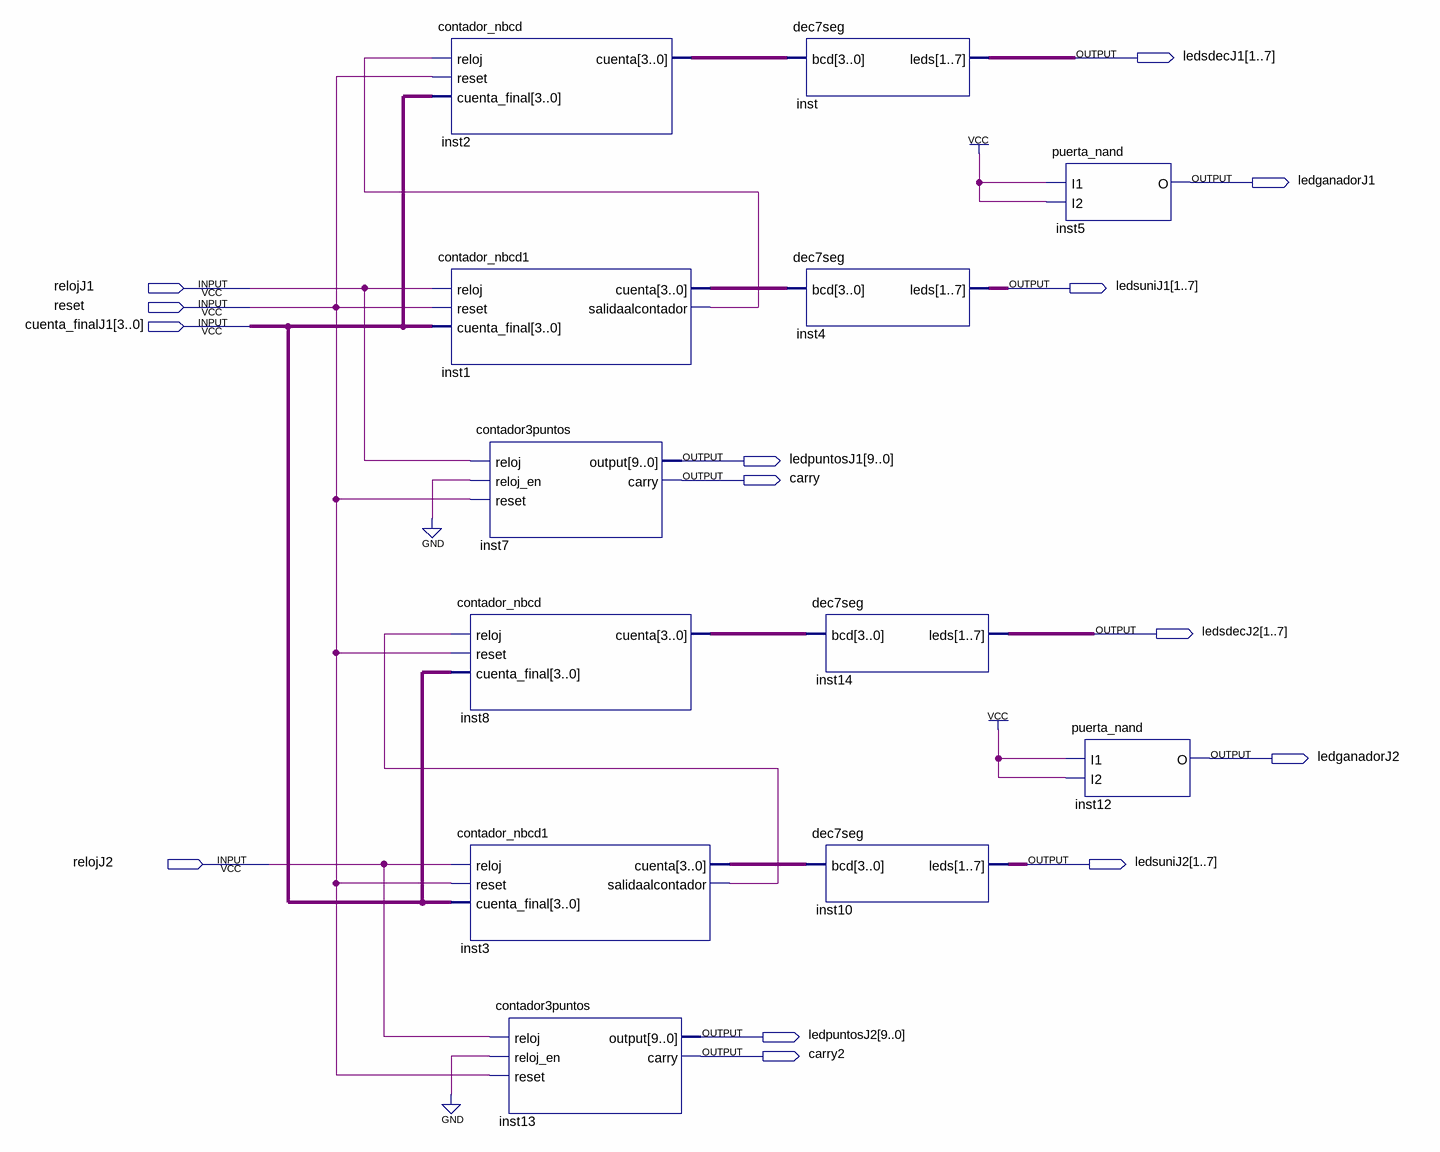
[diagram p0: schematic sheet]
// Quartus schematic Block1.bdf as structural Verilog: 12 symbols, 14 pins
module Block1 (
  input  relojJ1,
  input  reset,
  input  [3:0] cuenta_finalJ1,
  input  relojJ2,
  output [1:7] ledsdecJ1,
  output ledganadorJ1,
  output [1:7] ledsuniJ1,
  output [9:0] ledpuntosJ1,
  output carry,
  output [1:7] ledsdecJ2,
  output ledganadorJ2,
  output [1:7] ledsuniJ2,
  output [9:0] ledpuntosJ2,
  output carry2
);

  wire inst1_salidaalcontador, inst3_salidaalcontador;
  wire [3:0] inst1_cuenta, inst2_cuenta, inst3_cuenta, inst8_cuenta;

  contador_nbcd inst2 (
    .reloj(inst1_salidaalcontador), .reset(reset), .cuenta_final(cuenta_finalJ1), .cuenta(inst2_cuenta));
  contador_nbcd1 inst1 (
    .reloj(relojJ1), .reset(reset), .cuenta_final(cuenta_finalJ1), .cuenta(inst1_cuenta),
    .salidaalcontador(inst1_salidaalcontador));
  contador3puntos inst7 (.reloj(relojJ1), .reloj_en(1'b0), .reset(reset), .\output (ledpuntosJ1), .carry(carry));
  contador_nbcd inst8 (
    .reloj(inst3_salidaalcontador), .reset(reset), .cuenta_final(cuenta_finalJ1), .cuenta(inst8_cuenta));
  contador_nbcd1 inst3 (
    .reloj(relojJ2), .reset(reset), .cuenta_final(cuenta_finalJ1), .cuenta(inst3_cuenta),
    .salidaalcontador(inst3_salidaalcontador));
  contador3puntos inst13 (.reloj(relojJ2), .reloj_en(1'b0), .reset(reset), .\output (ledpuntosJ2), .carry(carry2));
  dec7seg inst (.bcd(inst2_cuenta), .leds(ledsdecJ1));
  dec7seg inst4 (.bcd(inst1_cuenta), .leds(ledsuniJ1));
  dec7seg inst14 (.bcd(inst8_cuenta), .leds(ledsdecJ2));
  dec7seg inst10 (.bcd(inst3_cuenta), .leds(ledsuniJ2));
  puerta_nand inst5 (.I1(1'b1), .I2(1'b1), .O(ledganadorJ1));
  puerta_nand inst12 (.I1(1'b1), .I2(1'b1), .O(ledganadorJ2));
endmodule
